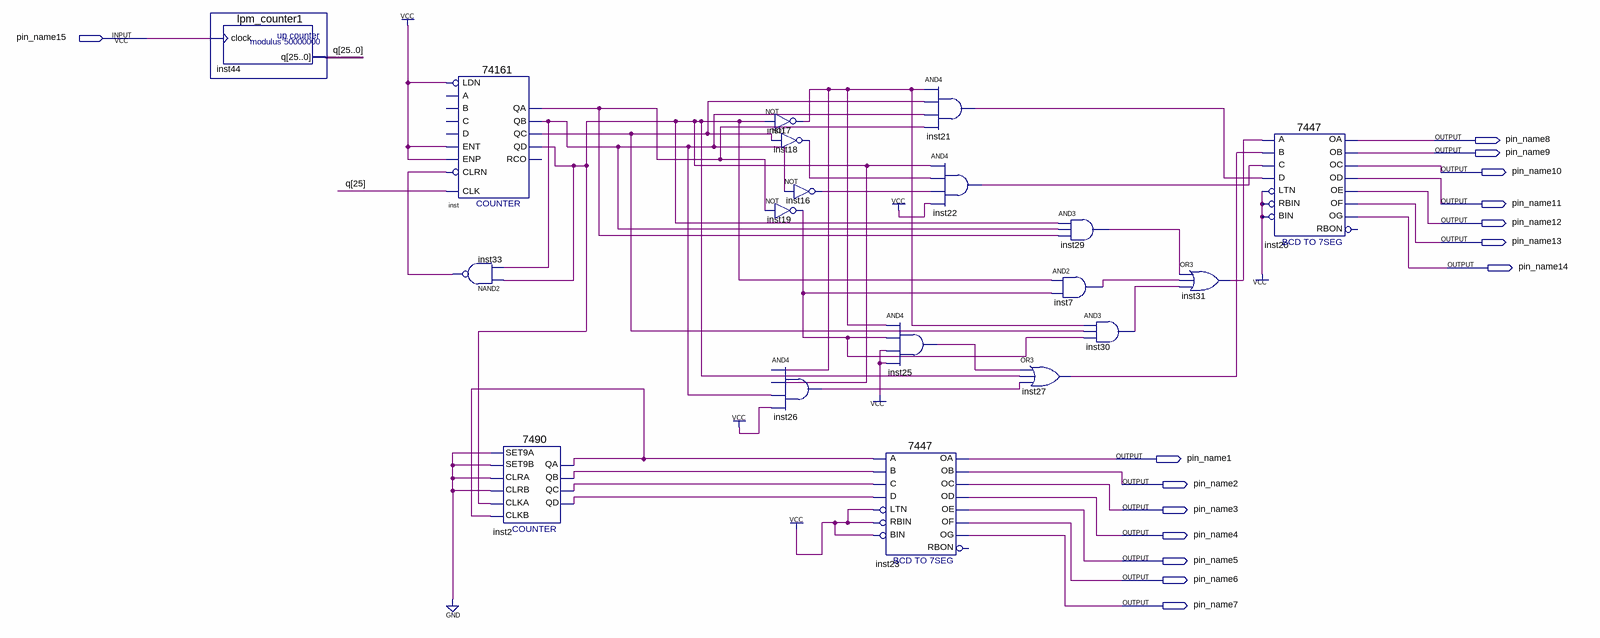
[diagram p0: schematic sheet]
// Quartus schematic zfzst.bdf as structural Verilog: 19 symbols, 15 pins
module zfzst (
  input  pin_name15,
  output pin_name8,
  output pin_name9,
  output pin_name10,
  output pin_name11,
  output pin_name12,
  output pin_name13,
  output pin_name14,
  output pin_name1,
  output pin_name2,
  output pin_name3,
  output pin_name4,
  output pin_name5,
  output pin_name6,
  output pin_name7
);

  wire inst2_qa, inst2_qb, inst2_qc, inst2_qd, inst7_out, inst16_out, inst17_out, inst18_out, inst19_out,
       inst21_out, inst22_out, inst25_out, inst26_out, inst27_out, inst29_out, inst30_out, inst31_out,
       inst33_out, inst_qa, inst_qb, inst_qc, inst_qd;
  wire [25:0] q;

  lpm_counter1 inst44 (.clock(pin_name15), .q(q));
  \74161  inst (
    .CLRN(inst33_out), .CLK(q[25]), .ENP(1'b1), .LDN(1'b1), .ENT(1'b1), .QD(inst_qd), .QC(inst_qc),
    .QB(inst_qb), .QA(inst_qa));  // open: A, D, B, C, RCO
  nand inst33 (inst33_out, inst_qd, inst_qb);
  \7490  inst2 (
    .SET9A(1'b0), .CLRA(1'b0), .SET9B(1'b0), .CLKB(inst2_qa), .CLKA(inst_qd), .CLRB(1'b0), .QD(inst2_qd),
    .QA(inst2_qa), .QB(inst2_qb), .QC(inst2_qc));
  not inst17 (inst17_out, inst_qd);
  not inst18 (inst18_out, inst_qc);
  not inst16 (inst16_out, inst_qb);
  not inst19 (inst19_out, inst_qa);
  and inst26 (inst26_out, inst17_out, inst_qd, inst_qb, 1'b1);
  and inst25 (inst25_out, inst17_out, inst19_out, 1'b1, 1'b1);
  \7447  inst23 (
    .LTN(1'b1), .B(inst2_qb), .C(inst2_qc), .D(inst2_qd), .RBIN(1'b1), .BIN(1'b1), .A(inst2_qa),
    .OB(pin_name2), .OC(pin_name3), .OE(pin_name5), .OD(pin_name4), .OF(pin_name6), .OG(pin_name7),
    .OA(pin_name1));  // open: RBON
  and inst21 (inst21_out, inst17_out, inst_qc, inst_qb, inst_qa);
  and inst22 (inst22_out, inst_qd, inst18_out, inst16_out, 1'b1);
  and inst29 (inst29_out, inst_qd, inst_qb, inst_qa);
  and inst7 (inst7_out, inst_qd, inst19_out);
  or inst27 (inst27_out, inst25_out, inst_qd, inst26_out);
  and inst30 (inst30_out, inst17_out, inst_qc, inst19_out);
  or inst31 (inst31_out, inst29_out, inst7_out, inst30_out);
  \7447  inst20 (
    .LTN(1'b1), .B(inst27_out), .C(inst22_out), .D(inst21_out), .RBIN(1'b1), .BIN(1'b1), .A(inst31_out),
    .OB(pin_name9), .OC(pin_name10), .OE(pin_name12), .OD(pin_name11), .OF(pin_name13), .OG(pin_name14),
    .OA(pin_name8));  // open: RBON
endmodule
